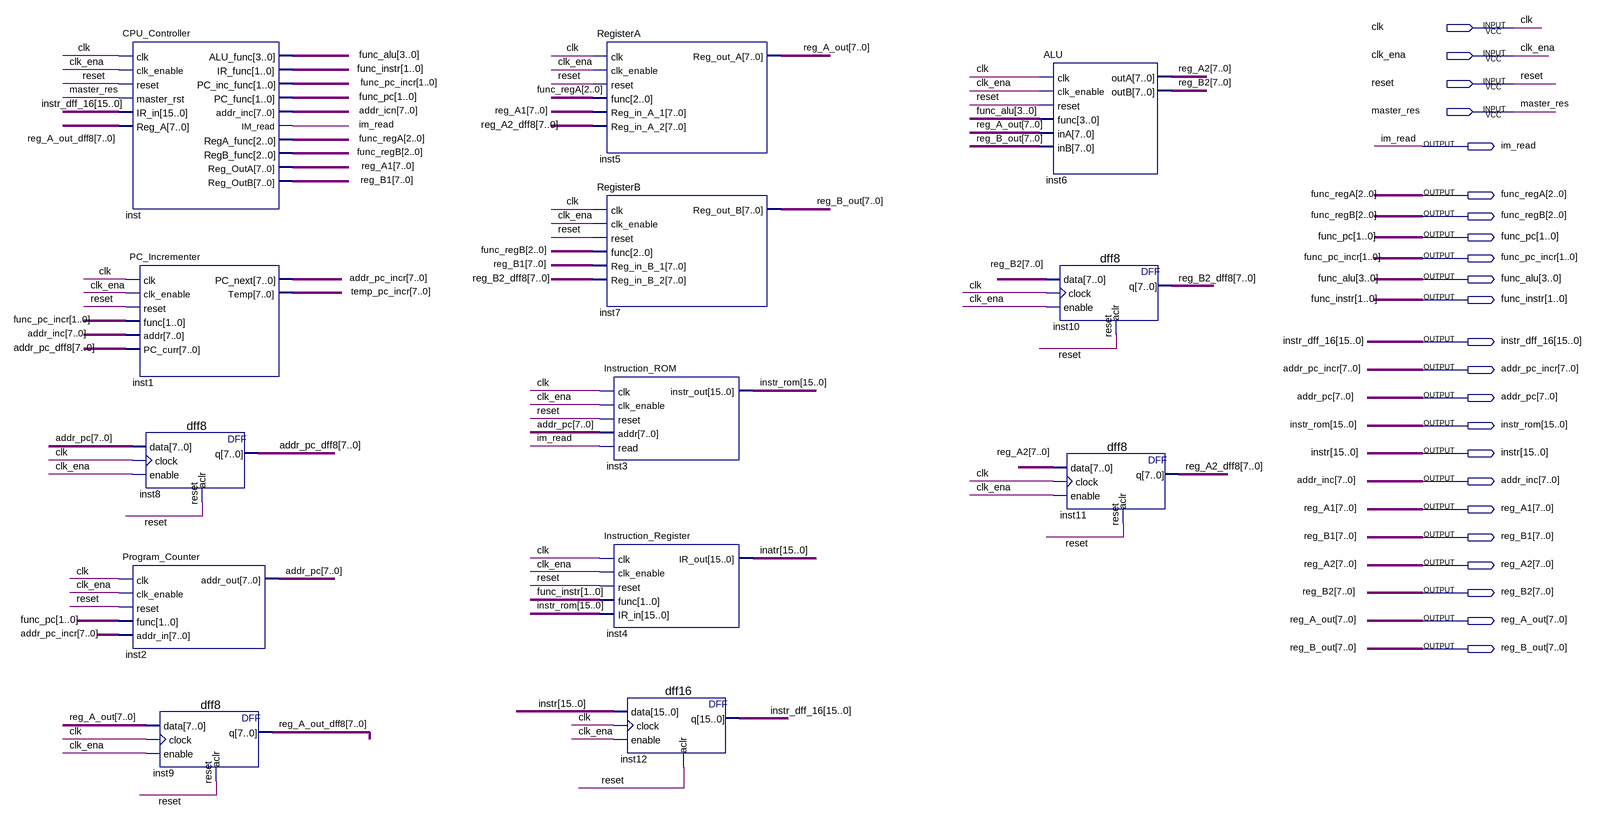
[diagram p0: schematic sheet]
// Quartus schematic CPU.bdf as structural Verilog: 13 symbols, 23 pins
module CPU (
  input  clk,
  input  clk_ena,
  input  reset,
  input  master_res,
  output im_read,
  output [2:0] func_regA,
  output [2:0] func_regB,
  output [1:0] func_pc,
  output [1:0] func_pc_incr,
  output [3:0] func_alu,
  output [1:0] func_instr,
  output [15:0] instr_dff_16,
  output [7:0] addr_pc_incr,
  output [7:0] addr_pc,
  output [15:0] instr_rom,
  output [15:0] instr,
  output [7:0] addr_inc,
  output [7:0] reg_A1,
  output [7:0] reg_B1,
  output [7:0] reg_A2,
  output [7:0] reg_B2,
  output [7:0] reg_A_out,
  output [7:0] reg_B_out
);

  wire [7:0] addr_icn, addr_pc_dff8, reg_A2_dff8, reg_A_out_dff8, reg_B2_dff8, temp_pc_incr;
  wire [15:0] inatr;

  CPU_Controller inst (
    .clk(clk), .clk_enable(clk_ena), .reset(reset), .master_rst(master_res), .IR_in(instr_dff_16),
    .Reg_A(reg_A_out_dff8), .ALU_func(func_alu), .IR_func(func_instr), .PC_inc_func(func_pc_incr),
    .PC_func(func_pc), .addr_inc(addr_icn), .IM_read(im_read), .RegA_func(func_regA), .RegB_func(func_regB),
    .Reg_OutA(reg_A1), .Reg_OutB(reg_B1));
  Program_Counter inst2 (
    .clk(clk), .clk_enable(clk_ena), .reset(reset), .func(func_pc), .addr_in(addr_pc_incr), .addr_out(addr_pc));
  PC_Incrementer inst1 (
    .clk(clk), .clk_enable(clk_ena), .reset(reset), .func(func_pc_incr), .addr(addr_inc),
    .PC_curr(addr_pc_dff8), .PC_next(addr_pc_incr), .Temp(temp_pc_incr));
  dff8 inst8 (.data(addr_pc), .clock(clk), .enable(clk_ena), .aclr(reset), .q(addr_pc_dff8));
  dff8 inst9 (.data(reg_A_out), .clock(clk), .enable(clk_ena), .aclr(reset), .q(reg_A_out_dff8));
  RegisterA inst5 (
    .clk(clk), .clk_enable(clk_ena), .reset(reset), .func(func_regA), .Reg_in_A_1(reg_A1),
    .Reg_in_A_2(reg_A2_dff8), .Reg_out_A(reg_A_out));
  RegisterB inst7 (
    .clk(clk), .clk_enable(clk_ena), .reset(reset), .func(func_regB), .Reg_in_B_1(reg_B1),
    .Reg_in_B_2(reg_B2_dff8), .Reg_out_B(reg_B_out));
  Instruction_ROM inst3 (
    .clk(clk), .clk_enable(clk_ena), .reset(reset), .addr(addr_pc), .read(im_read), .instr_out(instr_rom));
  Instruction_Register inst4 (
    .clk(clk), .clk_enable(clk_ena), .reset(reset), .func(func_instr), .IR_in(instr_rom), .IR_out(inatr));
  dff16 inst12 (.data(instr), .clock(clk), .enable(clk_ena), .aclr(reset), .q(instr_dff_16));
  ALU inst6 (
    .clk(clk), .clk_enable(clk_ena), .reset(reset), .func(func_alu), .inA(reg_A_out), .inB(reg_B_out),
    .outA(reg_A2), .outB(reg_B2));
  dff8 inst10 (.data(reg_B2), .clock(clk), .enable(clk_ena), .aclr(reset), .q(reg_B2_dff8));
  dff8 inst11 (.data(reg_A2), .clock(clk), .enable(clk_ena), .aclr(reset), .q(reg_A2_dff8));
endmodule
